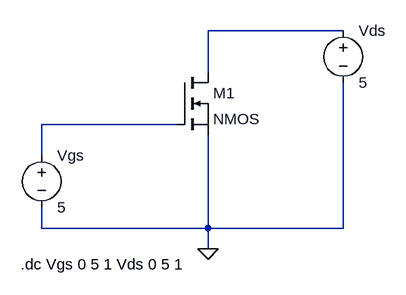
[diagram p0: schematic NmosD&T.asc]
NmosD&T.asc, the LTspice schematic file:
Version 4
SHEET 1 880 680
WIRE 448 64 240 64
WIRE 240 128 240 64
WIRE 192 208 -16 208
WIRE -16 256 -16 208
WIRE -16 368 -16 336
WIRE 240 368 240 224
WIRE 240 368 -16 368
WIRE 448 368 448 144
WIRE 448 368 240 368
WIRE 240 400 240 368
FLAG 240 400 0
SYMBOL nmos 192 128 R0
SYMATTR InstName M1
SYMBOL voltage -16 240 R0
WINDOW 123 0 0 Left 0
WINDOW 39 0 0 Left 0
SYMATTR InstName Vgs
SYMATTR Value 5
SYMBOL voltage 448 48 R0
WINDOW 123 0 0 Left 0
WINDOW 39 0 0 Left 0
SYMATTR InstName Vds
SYMATTR Value 5
TEXT -48 424 Left 2 !.dc Vgs 0 5 1 Vds 0 5 1

The netlist it stands for:
* NmosD&T.asc
M1 N001 N002 0 0 NMOS
Vgs N002 0 5
Vds N001 0 5
.model NMOS NMOS
.model PMOS PMOS
.lib standard.mos
.dc Vgs 0 5 1 Vds 0 5 1
.backanno
.end